# Altium project 激光测距1602.PrjPcb
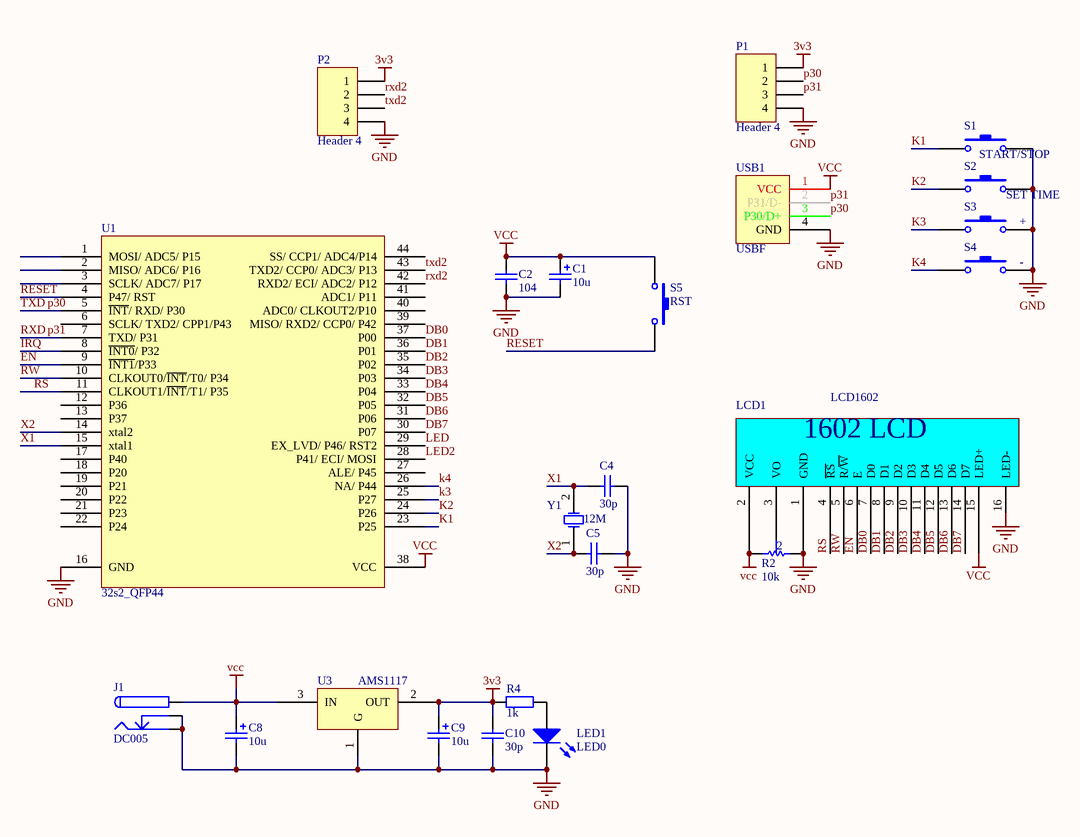
[diagram p0: 激光测距1602.SchDoc]
1 sheet, 23 parts. Net scope: global (net labels, ports and power ports of the same name join across sheets).
Board file: 激光测距1602.PcbDoc

## Sheet 激光测距1602.SchDoc
size A4

### Parts
C1  10u  [rb.1/.2]
C2  104  [0805c]
C4  30p  [0805c]
C5  30p  [0805c]
C8  10u  [rb.1/.2]
C9  10u  [rb.1/.2]
C10  30p  [0805c]
J1  DC005  [dc00521]
LCD1  LCD1602  [LCD1602]
LED1  LED0  [led3 red]
P1  Header 4  [HDR1X4]
P2  Header 4  [HDR1X4]
R2  10k  [3362]
R4  1k  [0805r]
S1  START/STOP  [PB6*6-dip]
S2  SET TIME  [PB6*6-dip]
S3  +  [PB6*6-dip]
S4  -  [PB6*6-dip]
S5  RST  [PB6*6-dip]
U1  32s2_QFP44  [LQFP44]
U3  AMS1117  [SOT223]
USB1  USBF  [USBAm]
Y1  12M  [HC49S]

### Nets
3v3: C9.1 C10.1 P1.1 P2.1 R4.1 U3.2(OUT)
GND: C1.2 C2.1 C4.1 C5.1 C8.2 C9.2 C10.2 J1.2 J1.3 LCD1.1(GND) LCD1.16(LED-) LED1.2(K) P1.4 P2.4 R2.3(B) S1.2 S2.2 S3.2 S4.2 U1.16(GND) U3.1(G) USB1.4(GND)
VCC: C1.1 C2.2 C8.1 J1.1 LCD1.2(VCC) LCD1.15(LED+) R2.1(A) S5.1 U1.38(VCC) U3.3(IN) USB1.1(VCC)
DB0: LCD1.7(D0) U1.37(P00)
DB1: LCD1.8(D1) U1.36(P01)
DB2: LCD1.9(D2) U1.35(P02)
DB3: LCD1.10(D3) U1.34(P03)
DB4: LCD1.11(D4) U1.33(P04)
DB5: LCD1.12(D5) U1.32(P05)
DB6: LCD1.13(D6) U1.31(P06)
DB7: LCD1.14(D7) U1.30(P07)
EN: LCD1.6(E) U1.9(~{INT1}/P33)
IRQ: U1.8(~{INT0}/_P32)
K1: S1.1 U1.23(P25)
K2: S2.1 U1.24(P26)
K3: S3.1 U1.25(P27)
K4: S4.1 U1.26(NA/_P44)
LED: U1.29(EX_LVD/_P46/_RST2)
LED2: U1.28(P41/_ECI/_MOSI)
p30: P1.2 U1.5(~{INT}/_RXD/_P30) USB1.3(P30/D+)  [also labelled TXD]
p31: P1.3 U1.7(TXD/_P31) USB1.2(P31/D-)  [also labelled RXD]
RESET: S5.2 U1.4(P47/_RST)
RS: LCD1.4(~{RS}) U1.11(CLKOUT1/~{INT}/T1/_P35)
RW: LCD1.5(R/~{W}) U1.10(CLKOUT0/~{INT}/T0/_P34)
rxd2: P2.2 U1.42(RXD2/_ECI/_ADC2/_P12)
txd2: P2.3 U1.43(TXD2/_CCP0/_ADC3/_P13)
X1: C4.2 U1.15(xtal1) Y1.2(OSC2)
X2: C5.2 U1.14(xtal2) Y1.1(OSC1)
NetLCD1_3: LCD1.3(VO) R2.2
NetLED1_1: LED1.1(A) R4.2

Not connected (* = marked no-connect by the designer): S1 3 4; S2 3 4; S3 3 4; S4 3 4; S5 3 4; U1 1(MOSI/_ADC5/_P15) 2(MISO/_ADC6/_P16) 3(SCLK/_ADC7/_P17) 6(SCLK/_TXD2/_CPP1/P43) 12(P36) 13(P37) 17(P40) 18(P20) 19(P21) 20(P22) 21(P23) 22(P24) 27(ALE/_P45) 39(MISO/_RXD2/_CCP0/_P42) 40(ADC0/_CLKOUT2/P10) 41(ADC1/_P11) 44(SS/_CCP1/_ADC4/P14)

### Notes on the sheet
- (in symbol LCD1602) 1602 LCD

### Library data of the parts
C1 C8 C9 = Cap Pol1: 有极性电容器; Published: 8-Jun-2000; LatestRevisionDate: 17-Jul-2002; LatestRevisionNote: Re-released for DXP Platform.; PackageReference: RB7.6-15; Publisher: Altium Limited; PackageDescription: Polarized Capacitor (Radial); 2 Leads
C2 C4 C5 C10 = Cap: 瓷片电容; Published: 8-Jun-2000; LatestRevisionDate: 17-Jul-2002; LatestRevisionNote: Re-released for DXP Platform.; PackageReference: RAD-0.3; Publisher: Altium Limited; PackageDescription: Radial Cap, Thru-Hole; 2 Leads; 0.3 in Pin Spacing
J1 = DC005: 电源插座
LCD1 = LCD1602: 16*2字符显示模块
LED1 = LED0: 发光二极管; Published: 8-Jun-2000; LatestRevisionDate: 08-Jul-2005; LatestRevisionNote: Mech Layer 1 removed.; PackageReference: LED-0; Publisher: Altium Limited; PackageDescription: LED; 2 Leads
P1 P2 = Header 4: 直排针; LatestRevisionDate: 17-Jul-2002; LatestRevisionNote: Re-released for DXP Platform.; Publisher: Altium Limited
R2 = Res Tap: 电位器; Sim Note: Enter the Resistance value and the set point into parameter fields.; Set Position: 0.5; Published: 24-Mar-1999; LatestRevisionDate: 17-Jul-2002; LatestRevisionNote: Re-released for DXP Platform.; PackageReference: VR3; Publisher: Altium Limited; PackageDescription: Variable Resistor, Thru-Hole; 3 Leads
R4 = Res2: 电阻; Published: 8-Jun-2000; LatestRevisionDate: 17-Jul-2002; LatestRevisionNote: Re-released for DXP Platform.; PackageReference: AXIAL-0.4; Publisher: Altium Limited; PackageDescription: Axial Device, Thru-Hole; 2 Leads; 0.4 in Pin Spacing
S1-S5 = SW-PB: Published: 24-Mar-1999; LatestRevisionDate: 17-Jul-2002; LatestRevisionNote: Re-released for DXP Platform.; PackageReference: SPST-2; Publisher: Altium Limited; PackageDescription: Switch; 2 Leads
U3 = AMS1117: 3.3V线性稳压芯片
USB1 = USBF: USB插件
Y1 = XTAL: 无源晶振; Published: 8-Jun-2000; LatestRevisionDate: 17-Jul-2002; LatestRevisionNote: Re-released for DXP Platform.; PackageReference: R38; Publisher: Altium Limited; PackageDescription: Crystal, Thru-Hole; 2 Leads; Body 3.1 x 8.2 mm (Dia.xH)